# Altium schematic sheet PPU2.SchDoc
size A4; DocumentNumber: 2; SheetNumber: 3; SheetTotal: 7
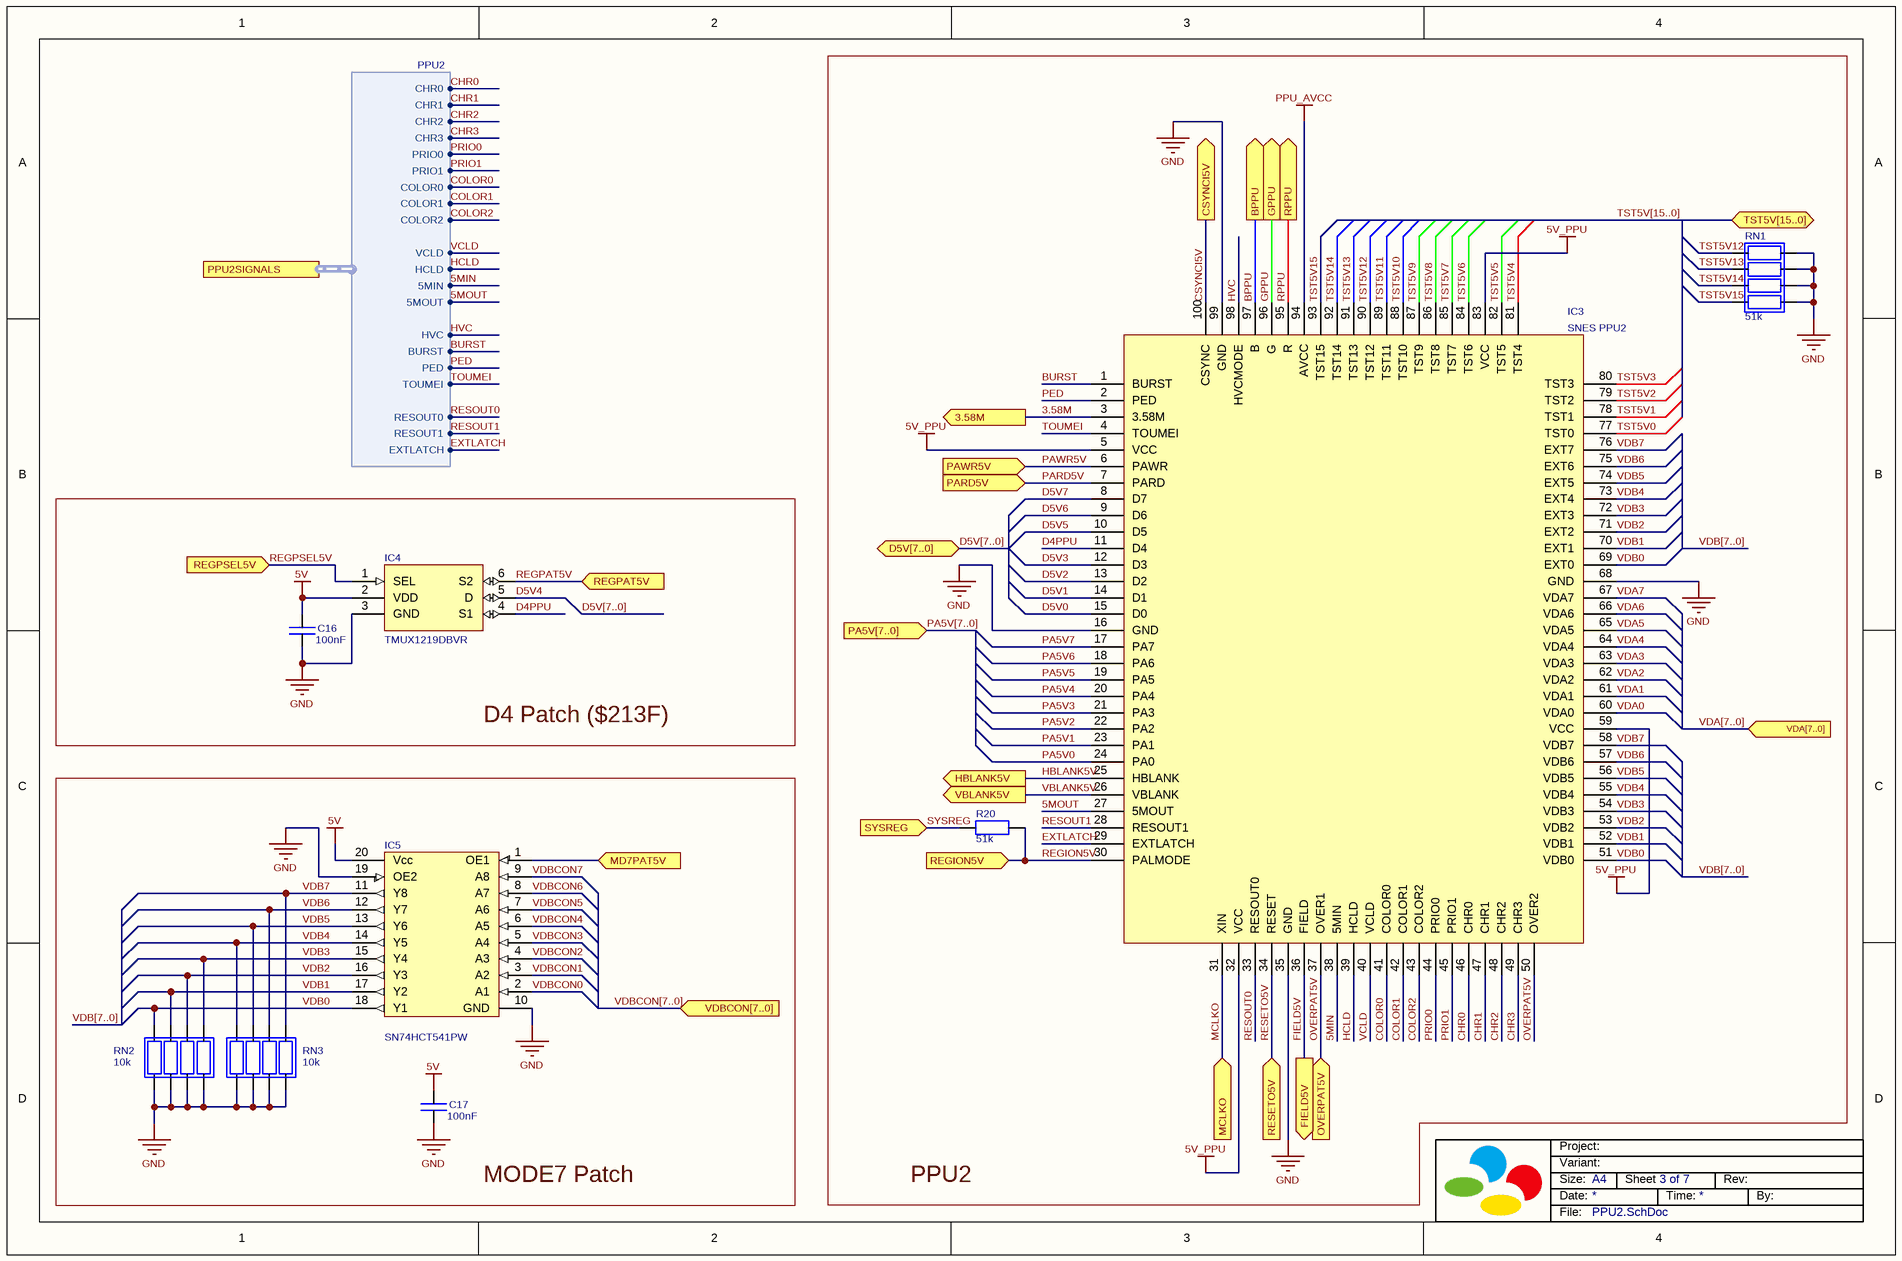
[diagram p0: PPU2.SchDoc]

## Parts
C16  value 100nF  [Cap_0402_Chip]  (hidden comment: Ceramic Capacitor 100nF 10V ±20% X7R 0402)
C17  value 100nF  [Cap_0402_Chip]  (hidden comment: Ceramic Capacitor 100nF 10V ±20% X7R 0402)
IC3  SNES PPU2  [PPU100Pin]  (no BOM)
IC4  Manufacturer_Part_Number: TMUX1219DBVR  [SOT23-6]  (hidden comment: TMUX1219)
IC5  Manufacturer_Part_Number: SN74HCT541PW  [TSSOP20 Narrow]  (hidden comment: SN74HCT541)
R20  value 51k  [Res_0402_Chip]  (hidden comment: Resistor 51k 0402 ±1%)
RN1  value 51k  [1206_Array_Chip]  (hidden comment: Resistor Network 51k 1206 ±1%)
RN2  value 10k  [1206_Array_Chip]  (hidden comment: Resistor Network 10k 1206 ±1%)
RN3  value 10k  [1206_Array_Chip]  (hidden comment: Resistor Network 10k 1206 ±1%)

## Blocks framed on the sheet
PPU2: IC3 R20 RN1
D4 Patch ($213F): C16 IC4
MODE7 Patch: C17 IC5 RN2 RN3

## Ports
3.58M (out), BPPU (out), CSYNCI5V (out), D5V[7..0] (bidir), FIELD5V (out), GPPU (out), HBLANK5V (out), MCLKO (in), MD7PAT5V (in), OVERPAT5V (in), PA5V[7..0] (in), PARD5V (in), PAWR5V (in), PPU2SIGNALS (harness PPU2), REGION5V (in), REGPAT5V (in), REGPSEL5V (in), RESETO5V (in), RPPU (out), SYSREG (in), TST5V[15..0] (bidir), VBLANK5V (out), VDA[7..0] (in), VDBCON[7..0] (in)

## Harnesses
PPU2: CHR0, CHR1, CHR2, CHR3, PRIO0, PRIO1, COLOR0, COLOR1, COLOR2, VCLD, HCLD, 5MIN, 5MOUT, HVC, BURST, PED, TOUMEI, RESOUT0, RESOUT1, EXTLATCH

## Nets
5V: C16.1 C17.1 IC4.2(VDD) IC5.20(Vcc)
5V_PPU: IC3.5(VCC) IC3.32(VCC) IC3.59(VCC) IC3.83(VCC)
GND: C16.2 C17.2 IC3.16(GND) IC3.35(GND) IC3.68(GND) IC3.99(GND) IC4.3(GND) IC5.10(GND) IC5.19(OE2) RN1.1 RN1.2 RN1.3 RN1.4 RN2.1 RN2.2 RN2.3 RN2.4 RN3.1 RN3.2 RN3.3 RN3.4
PPU_AVCC: IC3.94(AVCC)
3.58M: IC3.3(3.58M) ; port 3.58M
5MIN: IC3.38(5MIN) ; port PPU2SIGNALS.5MIN
5MOUT: IC3.27(5MOUT) ; port PPU2SIGNALS.5MOUT
BPPU: IC3.97(B) ; port BPPU
BURST: IC3.1(BURST) ; port PPU2SIGNALS.BURST
CHR0: IC3.46(CHR0) ; port PPU2SIGNALS.CHR0
CHR1: IC3.47(CHR1) ; port PPU2SIGNALS.CHR1
CHR2: IC3.48(CHR2) ; port PPU2SIGNALS.CHR2
CHR3: IC3.49(CHR3) ; port PPU2SIGNALS.CHR3
COLOR0: IC3.41(COLOR0) ; port PPU2SIGNALS.COLOR0
COLOR1: IC3.42(COLOR1) ; port PPU2SIGNALS.COLOR1
COLOR2: IC3.43(COLOR2) ; port PPU2SIGNALS.COLOR2
CSYNCI5V: IC3.100(CSYNC) ; port CSYNCI5V
D4PPU: IC3.11(D4) IC4.4(S1)
D5V0: IC3.15(D0)
D5V1: IC3.14(D1)
D5V2: IC3.13(D2)
D5V3: IC3.12(D3)
D5V4: IC4.5(D)
D5V5: IC3.10(D5)
D5V6: IC3.9(D6)
D5V7: IC3.8(D7)
EXTLATCH: IC3.29(EXTLATCH) ; port PPU2SIGNALS.EXTLATCH
FIELD5V: IC3.36(FIELD) ; port FIELD5V
GPPU: IC3.96(G) ; port GPPU
HBLANK5V: IC3.25(HBLANK) ; port HBLANK5V
HCLD: IC3.39(HCLD) ; port PPU2SIGNALS.HCLD
HVC: IC3.98(HVCMODE) ; port PPU2SIGNALS.HVC
MCLKO: IC3.31(XIN) ; port MCLKO
MD7PAT5V: IC5.1(OE1) ; port MD7PAT5V
OVERPAT5V: IC3.37(OVER1) IC3.50(OVER2) ; port OVERPAT5V
PA5V0: IC3.24(PA0)
PA5V1: IC3.23(PA1)
PA5V2: IC3.22(PA2)
PA5V3: IC3.21(PA3)
PA5V4: IC3.20(PA4)
PA5V5: IC3.19(PA5)
PA5V6: IC3.18(PA6)
PA5V7: IC3.17(PA7)
PARD5V: IC3.7(PARD) ; port PARD5V
PAWR5V: IC3.6(PAWR) ; port PAWR5V
PED: IC3.2(PED) ; port PPU2SIGNALS.PED
PRIO0: IC3.44(PRIO0) ; port PPU2SIGNALS.PRIO0
PRIO1: IC3.45(PRIO1) ; port PPU2SIGNALS.PRIO1
REGION5V: IC3.30(PALMODE) R20.1 ; port REGION5V
REGPAT5V: IC4.6(S2) ; port REGPAT5V
REGPSEL5V: IC4.1(SEL) ; port REGPSEL5V
RESETO5V: IC3.34(RESET) ; port RESETO5V
RESOUT0: IC3.33(RESOUT0) ; port PPU2SIGNALS.RESOUT0
RESOUT1: IC3.28(RESOUT1) ; port PPU2SIGNALS.RESOUT1
RPPU: IC3.95(R) ; port RPPU
SYSREG: R20.2 ; port SYSREG
TOUMEI: IC3.4(TOUMEI) ; port PPU2SIGNALS.TOUMEI
TST5V0: IC3.77(TST0)
TST5V1: IC3.78(TST1)
TST5V2: IC3.79(TST2)
TST5V3: IC3.80(TST3)
TST5V4: IC3.81(TST4)
TST5V5: IC3.82(TST5)
TST5V6: IC3.84(TST6)
TST5V7: IC3.85(TST7)
TST5V8: IC3.86(TST8)
TST5V9: IC3.87(TST9)
TST5V10: IC3.88(TST10)
TST5V11: IC3.89(TST11)
TST5V12: IC3.90(TST12) RN1.5
TST5V13: IC3.91(TST13) RN1.6
TST5V14: IC3.92(TST14) RN1.7
TST5V15: IC3.93(TST15) RN1.8
VBLANK5V: IC3.26(VBLANK) ; port VBLANK5V
VCLD: IC3.40(VCLD) ; port PPU2SIGNALS.VCLD
VDA0: IC3.60(VDA0)
VDA1: IC3.61(VDA1)
VDA2: IC3.62(VDA2)
VDA3: IC3.63(VDA3)
VDA4: IC3.64(VDA4)
VDA5: IC3.65(VDA5)
VDA6: IC3.66(VDA6)
VDA7: IC3.67(VDA7)
VDB0: IC3.51(VDB0) IC3.69(EXT0) IC5.18(Y1) RN2.8
VDB1: IC3.52(VDB1) IC3.70(EXT1) IC5.17(Y2) RN2.7
VDB2: IC3.53(VDB2) IC3.71(EXT2) IC5.16(Y3) RN2.6
VDB3: IC3.54(VDB3) IC3.72(EXT3) IC5.15(Y4) RN2.5
VDB4: IC3.55(VDB4) IC3.73(EXT4) IC5.14(Y5) RN3.8
VDB5: IC3.56(VDB5) IC3.74(EXT5) IC5.13(Y6) RN3.7
VDB6: IC3.57(VDB6) IC3.75(EXT6) IC5.12(Y7) RN3.6
VDB7: IC3.58(VDB7) IC3.76(EXT7) IC5.11(Y8) RN3.5
VDBCON0: IC5.2(A1)
VDBCON1: IC5.3(A2)
VDBCON2: IC5.4(A3)
VDBCON3: IC5.5(A4)
VDBCON4: IC5.6(A5)
VDBCON5: IC5.7(A6)
VDBCON6: IC5.8(A7)
VDBCON7: IC5.9(A8)

## Buses and harness runs
bus D5V[7..0]
bus D5V[7..0] = port D5V[7..0]
bus PA5V[7..0] = port PA5V[7..0]
bus TST5V[15..0] = port TST5V[15..0]
bus VDA[7..0] = port VDA[7..0]
bus VDB[7..0]
bus VDBCON[7..0] = port VDBCON[7..0]

## Notes on the sheet
- Size:
- Date:
- Variant:
- Project:
- A4
- Sheet
- Time:
- Rev:
- By:
- File:

## Library data of the parts
C16 C17 = Capacitor: ChipSize: 0402; NominalVoltage: 10V; Dielectric: X7R; Tolerance: ±20%; PartType: Ceramic Capacitor
IC3 = PPU2100Pin: PPU2; Manufacturer: Nintendo; Manufacturer_Part_Number: PPU2
IC4 = TMUX1219: 2:1 MUX; Manufacturer: Texas Instruments
IC5 = SN74HCT541: Manufacturer: Texas Instruments
R20 = R: ChipSize: 0402; Tolerance: ±1%; PartType: Resistor
RN1-RN3 = RNetwork: ChipSize: 1206; Tolerance: ±1%; PartType: Resistor Network